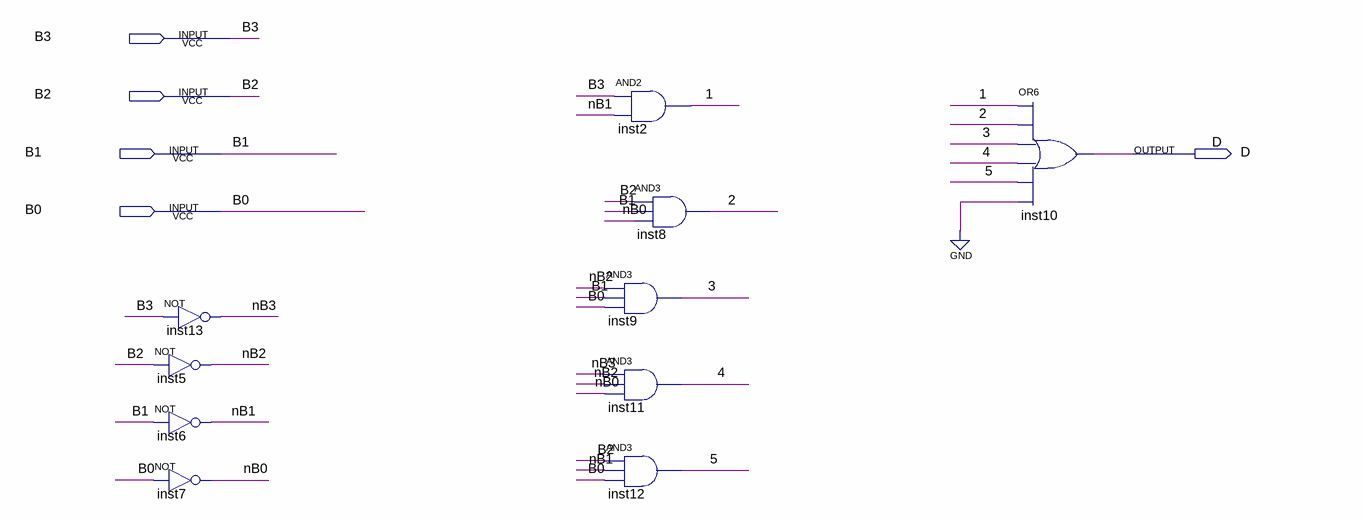
[diagram p0: schematic sheet]
// Quartus schematic D.bdf as structural Verilog: 10 symbols, 5 pins
module D (
  input  B3,
  input  B2,
  input  B1,
  input  B0,
  output D
);

  wire \1 , \2 , \3 , \4 , \5 , nB0, nB1, nB2, nB3;

  not inst13 (nB3, B3);
  not inst5 (nB2, B2);
  not inst6 (nB1, B1);
  not inst7 (nB0, B0);
  and inst9 (\3 , nB2, B1, B0);
  and inst11 (\4 , nB3, nB2, nB0);
  and inst12 (\5 , B2, nB1, B0);
  and inst2 (\1 , B3, nB1);
  and inst8 (\2 , B2, B1, nB0);
  or inst10 (D, \1 , \2 , \3 , \4 , \5 , 1'b0);
endmodule
